# Altium schematic sheet clock-dist.SchDoc: Clock Buffer
size Legal; CheckedBy: J. Brinton; CompanyName: Signal Laboratories, Inc.; DrawnBy: E. Chiu; Engineer: E. Chiu; Address1: 3479 Edison Way; Address2: Menlo Park CA 94025; Address3: +1 (877) 778-8435; Address4: siglabs.com; DocumentNumber: 37; Revision: 1; SheetNumber: 37; SheetTotal: 58
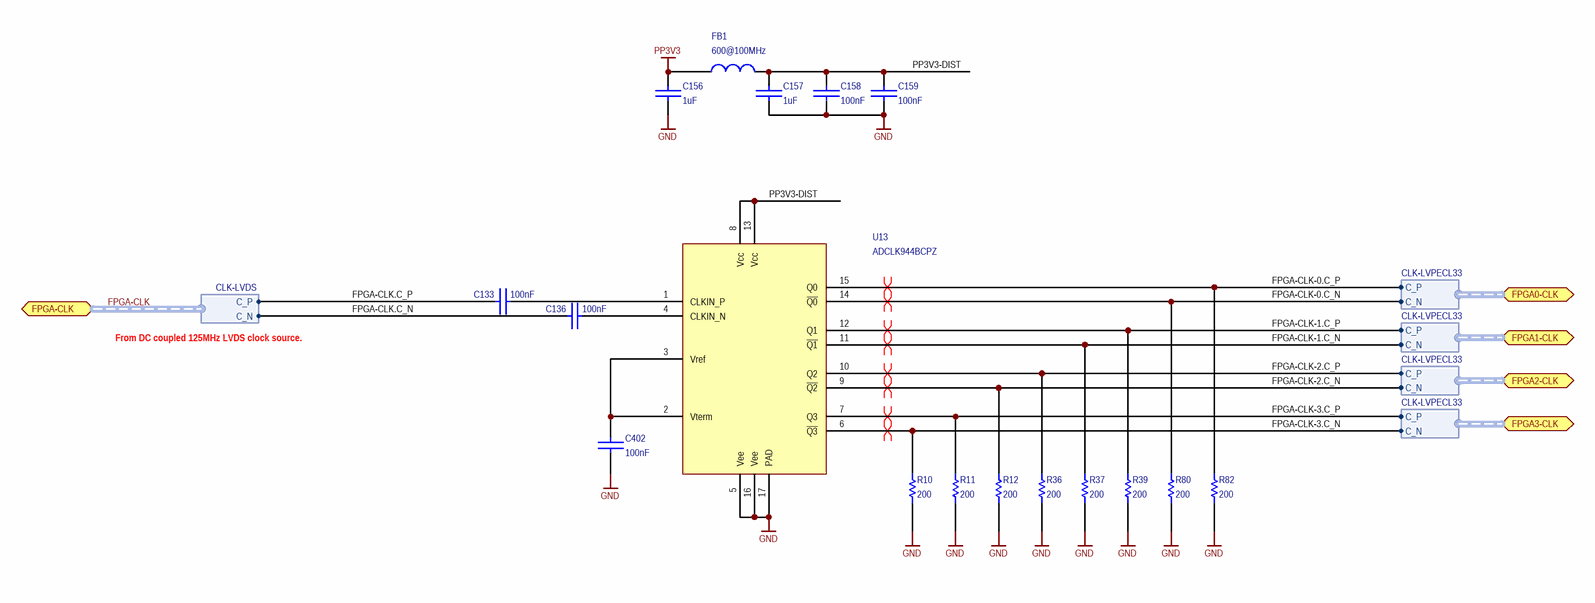
[diagram p0: clock-dist.SchDoc]

## Parts
C133  value 100nF  [0402]  (hidden comment: GRM155R71C104KA88J)
C136  value 100nF  [0402]  (hidden comment: GRM155R71C104KA88J)
C156  value 1uF  [0402]  (hidden comment: GRM155R61A105KE15D)
C157  value 1uF  [0402]  (hidden comment: GRM155R61A105KE15D)
C158  value 100nF  [0402]  (hidden comment: GRM155R71C104KA88J)
C159  value 100nF  [0402]  (hidden comment: GRM155R71C104KA88J)
C402  value 100nF  [0402]  (hidden comment: GRM155R71C104KA88J)
FB1  value 600@100MHz  [0805]  (hidden comment: ILHB0805ER601V)
R10  value 200  [0402]  (hidden comment: ERJ-2RKF2000X)
R11  value 200  [0402]  (hidden comment: ERJ-2RKF2000X)
R12  value 200  [0402]  (hidden comment: ERJ-2RKF2000X)
R36  value 200  [0402]  (hidden comment: ERJ-2RKF2000X)
R37  value 200  [0402]  (hidden comment: ERJ-2RKF2000X)
R39  value 200  [0402]  (hidden comment: ERJ-2RKF2000X)
R80  value 200  [0402]  (hidden comment: ERJ-2RKF2000X)
R82  value 200  [0402]  (hidden comment: ERJ-2RKF2000X)
U13  ADCLK944BCPZ  [WFQFN-16]

## Ports
FPGA0-CLK (harness CLK-LVPECL33), FPGA1-CLK (harness CLK-LVPECL33), FPGA2-CLK (harness CLK-LVPECL33), FPGA3-CLK (harness CLK-LVPECL33), FPGA-CLK (harness CLK-LVDS)

## Harnesses
CLK-LVDS: C_P, C_N
CLK-LVPECL33: C_P, C_N

## Nets
GND: C156.1 C157.1 C158.1 C159.1 C402.1 R10.2 R11.2 R12.2 R36.2 R37.2 R39.2 R80.2 R82.2 U13.5(Vee) U13.16(Vee) U13.17(PAD)
PP3V3: C156.2 FB1.2
FPGA-CLK-0.C_N: R80.1 U13.14(~{Q0}) ; port FPGA0-CLK.C_N
FPGA-CLK-0.C_P: R82.1 U13.15(Q0) ; port FPGA0-CLK.C_P
FPGA-CLK-1.C_N: R37.1 U13.11(~{Q1}) ; port FPGA1-CLK.C_N
FPGA-CLK-1.C_P: R39.1 U13.12(Q1) ; port FPGA1-CLK.C_P
FPGA-CLK-2.C_N: R12.1 U13.9(~{Q2}) ; port FPGA2-CLK.C_N
FPGA-CLK-2.C_P: R36.1 U13.10(Q2) ; port FPGA2-CLK.C_P
FPGA-CLK-3.C_N: R10.1 U13.6(~{Q3}) ; port FPGA3-CLK.C_N
FPGA-CLK-3.C_P: R11.1 U13.7(Q3) ; port FPGA3-CLK.C_P
FPGA-CLK.C_N: C136.2 ; port FPGA-CLK.C_N
FPGA-CLK.C_P: C133.2 ; port FPGA-CLK.C_P
PP3V3-DIST: C157.2 C158.2 C159.2 FB1.1 U13.8(Vcc) U13.13(Vcc)
NetC133_1: C133.1 U13.1(CLKIN_P)
NetC136_1: C136.1 U13.4(CLKIN_N)
NetC402_2: C402.2 U13.2(Vterm) U13.3(Vref)

## Buses and harness runs
harness FPGA-CLK = port FPGA-CLK

## Layout directives
differential pair: FPGA-CLK-0.C_N, FPGA-CLK-0.C_P, FPGA-CLK-1.C_N, FPGA-CLK-1.C_P, FPGA-CLK-2.C_N, FPGA-CLK-2.C_P, FPGA-CLK-3.C_N, FPGA-CLK-3.C_P

## Notes on the sheet
- From DC coupled 125MHz LVDS clock source.
- Title
- Engineer
- Revision
- Drawn By
- Checked By
- Date
- Sheet
- of

## Library data of the parts
C133 C136 C158 C159 C402 = CAP: Ceramic Capacitor SMD; Manufacturer: Murata; Voltage: 16V; Manufacturer P/N: GRM155R71C104KA88J; Package: 0402
C156 C157 = CAP: Ceramic Capacitor SMD; Manufacturer: Murata; Manufacturer P/N: GRM155R61A105KE15D; Package: 0402
FB1 = INDUCTANCE1: Ferrite Bead 600-Ohm @ 100MHz 0805; Manufacturer: Vishay Dale; Manufacturer P/N: ILHB0805ER601V; Package: 0805
R10-R12 R36 R37 R39 R80 R82 = RES 0402: Resistor, SMD 0402; Manufacturer: Panasonic; Package: 0402; Manufacturer P/N: ERJ-2RKF2000X; Do Not Place: *
U13 = ADCLK944: Ultra Low Jitter 1:4 Differential Clock Buffer; Manufacturer: Analog Devices; Manufacturer P/N: ADCLK944BCPZ